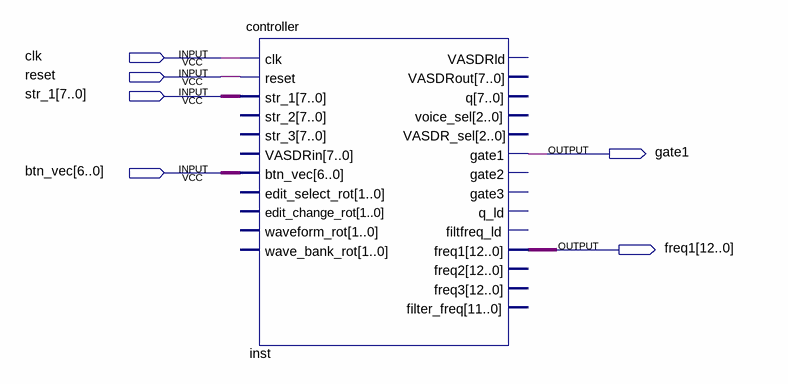
[diagram p0: schematic sheet]
// Quartus schematic controllertest.bdf as structural Verilog: 1 symbols, 6 pins
module controllertest (
  input  clk,
  input  reset,
  input  [7:0] str_1,
  input  [6:0] btn_vec,
  output gate1,
  output [12:0] freq1
);

  controller inst (
    .clk(clk), .reset(reset), .str_1(str_1), .btn_vec(btn_vec), .gate1(gate1), .freq1(freq1));  // open: str_2, str_3, VASDRin, edit_select_rot, edit_change_rot, waveform_rot, wave_bank_rot, VASDRld, VASDRout, q, voice_sel, VASDR_sel, gate2, gate3, q_ld, filtfreq_ld, freq2, freq3, filter_freq
endmodule
